# Altium schematic sheet Shift Register.SchDoc: 8ch_RGB_Controller
size A4; ApprovedBy: Selyutin A.; CheckedBy: Selyutin A.; Author: Selyutin A.; CompanyName: Circuit Craft Lab; DrawnBy: Selyutin A.; Engineer: Selyutin A.; Organization: Circuit Craft Lab; Address1: Russia; Address2: Nevinnomissk; DocumentNumber: 6; Revision: 1.0; SheetNumber: 3; SheetTotal: 5
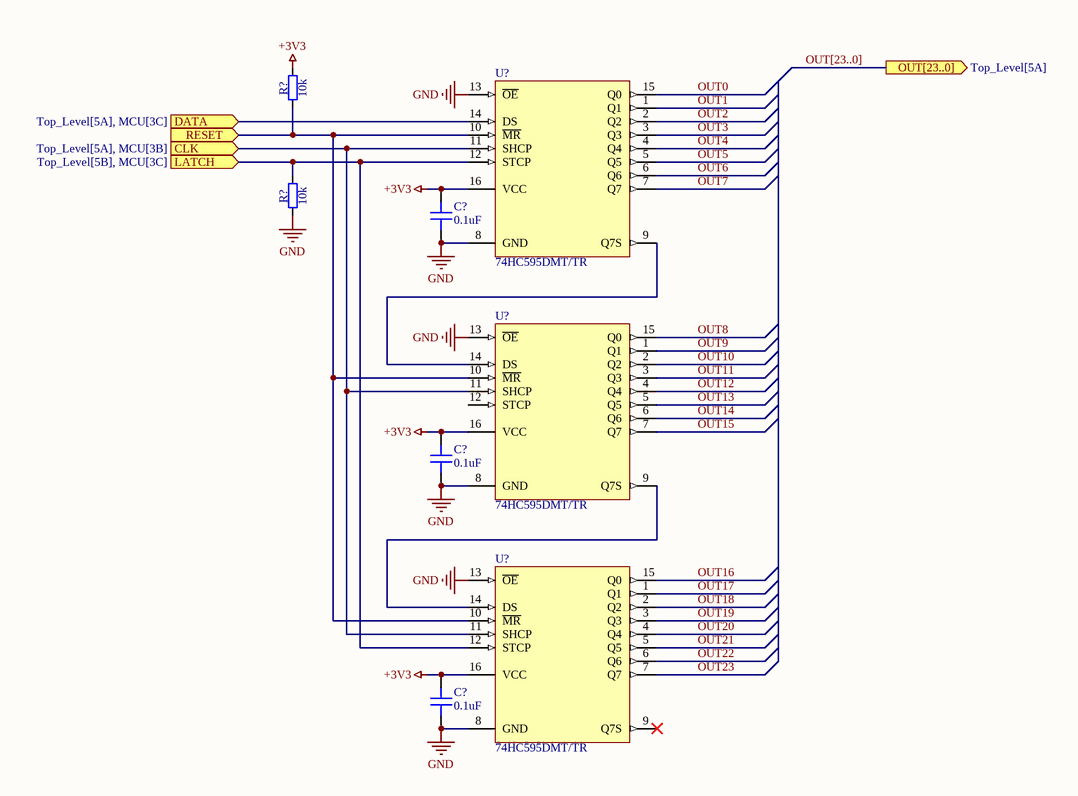
[diagram p0: Shift Register.SchDoc]

## Parts
(Parts that share a designator on the sheet are numbered #1, #2 ... from top to bottom, then left to right.)
C?#1  0.1uF  [CAPC1608X09N]
C?#2  0.1uF  [CAPC1608X09N]
C?#3  0.1uF  [CAPC1608X09N]
R?#1  10k  [RESC1608X55N]
R?#2  10k  [RESC1608X55N]
U?#1  74HC595DMT/TR  [SOP65P640X110-16N]
U?#2  74HC595DMT/TR  [SOP65P640X110-16N]
U?#3  74HC595DMT/TR  [SOP65P640X110-16N]

## Ports
CLK (in, see Top_Level[5A], MCU[3B]), DATA (in, see Top_Level[5A], MCU[3C]), LATCH (in, see Top_Level[5B], MCU[3C]), OUT[23..0] (out, see Top_Level[5A]), RESET (in)

## Nets
+3V3: C?#1.2 C?#2.2 C?#3.2 R?#1.2 U?#1.16(VCC) U?#2.16(VCC) U?#3.16(VCC)
GND: C?#1.1 C?#2.1 C?#3.1 R?#2.1 U?#1.8(GND) U?#1.13(~{OE}) U?#2.8(GND) U?#2.13(~{OE}) U?#3.8(GND) U?#3.13(~{OE})
CLK: U?#1.11(SHCP) U?#2.11(SHCP) U?#3.11(SHCP) ; port CLK
DATA: U?#1.14(DS) ; port DATA
LATCH: R?#2.2 U?#1.12(STCP) U?#3.12(STCP) ; port LATCH
OUT0: U?#1.15(Q0)
OUT1: U?#1.1(Q1)
OUT2: U?#1.2(Q2)
OUT3: U?#1.3(Q3)
OUT4: U?#1.4(Q4)
OUT5: U?#1.5(Q5)
OUT6: U?#1.6(Q6)
OUT7: U?#1.7(Q7)
OUT8: U?#2.15(Q0)
OUT9: U?#2.1(Q1)
OUT10: U?#2.2(Q2)
OUT11: U?#2.3(Q3)
OUT12: U?#2.4(Q4)
OUT13: U?#2.5(Q5)
OUT14: U?#2.6(Q6)
OUT15: U?#2.7(Q7)
OUT16: U?#3.15(Q0)
OUT17: U?#3.1(Q1)
OUT18: U?#3.2(Q2)
OUT19: U?#3.3(Q3)
OUT20: U?#3.4(Q4)
OUT21: U?#3.5(Q5)
OUT22: U?#3.6(Q6)
OUT23: U?#3.7(Q7)
RESET: R?#1.1 U?#1.10(~{MR}) U?#2.10(~{MR}) U?#3.10(~{MR}) ; port RESET
NetU?#1_9: U?#1.9(Q7S) U?#2.14(DS)
NetU?#2_9: U?#2.9(Q7S) U?#3.14(DS)

Not connected (* = marked no-connect by the designer): U?#2 12(STCP); U?#3 9(Q7S)*

## Buses and harness runs
bus OUT[23..0] = port OUT[23..0]

## Notes on the sheet
- Title:
- Author:
- Approved:
- Size:
- Date:
- Git Hash:
- A4
- Prj:
- SW Version:
- Variant:
- Edited:
- CONFIDENTIAL
- File:

## Library data of the parts
C?#1-C?#3 = 0603B104K500NT: Manufacturer: FH (Guangdong Fenghua Advanced Tech); Voltage: 50V; Tolerance: 10%; Dielectric: X7R; Min Temperature: -55; Max Temperature: 125; Part Number: 0603B104K500NT; ComponentLink1URL: https://datasheet.lcsc.com/lcsc/2304140030_FH--Guangdong-Fenghua-Advanced-Tech-0603B104K500NT_C30926.pdf; ComponentLink1Description: Datasheet; Package: 0603; Part Status: Active; Capacitance: 0.1uF
R?#1 R?#2 = WR06X1002FTL: Resistor; Manufacturer: Walsin Tech Corp; Tolerance: 1%; Power: 1/10 W; Temperature Coefficient: 100ppm; Min Temperature: -55°C; Max Temperature: 155°C; Part Number: WR06X1002FTL; ComponentLink1URL: https://datasheet.lcsc.com/lcsc/2304140030_Walsin-Tech-Corp-WR06X1002FTL_C108449.pdf; ComponentLink1Description: Datasheet; Package: 0603; Part Status: Active; Resistance: 10k
U?#1-U?#3 = 74HC595DMT/TR: IC SHIFT REGISTER 8BIT 16TSSOP; MANUFACTURER: HGSEMI; Part Number: 74HC595DMT/TR; COMPONENTLINK1URL: https://datasheet.lcsc.com/lcsc/2304111630_HGSEMI-74HC595DMT-TR_C5310887.pdf; COMPONENTLINK1DESCRIPTION: Datasheet; PACKAGE: TSSOP-16; Part Status: Active